# Altium schematic sheet SlowDAC.SchDoc: Slow DAC
size Letter
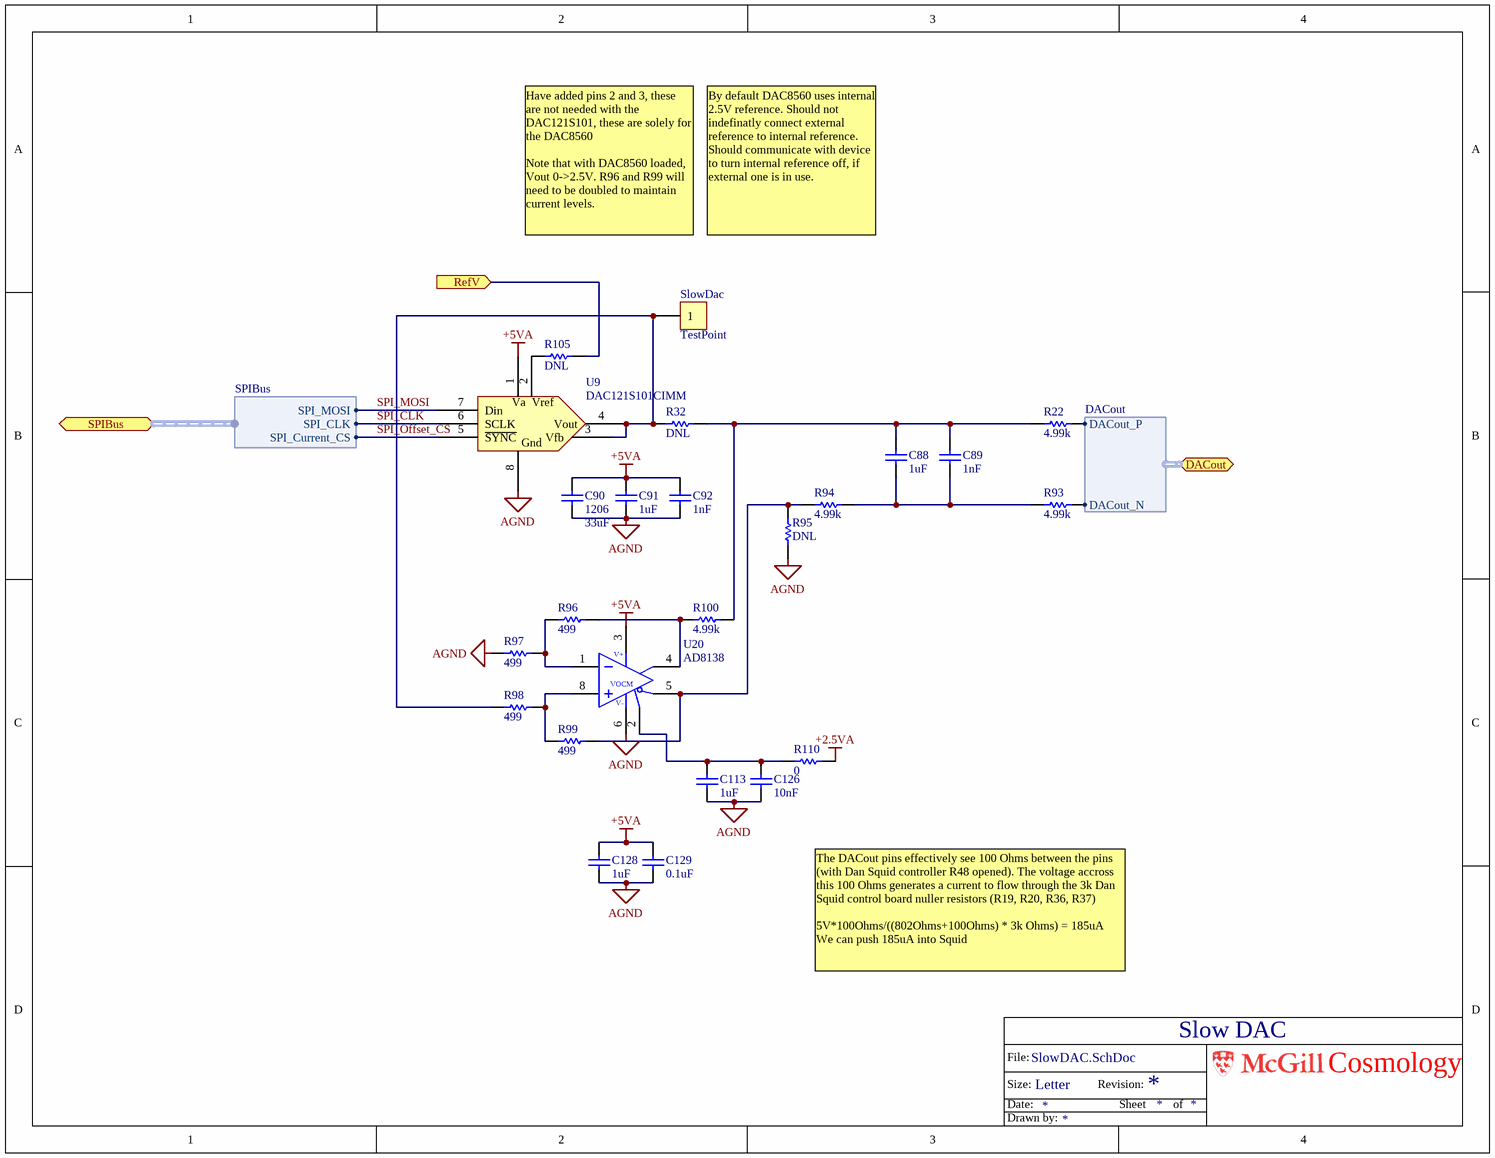
[diagram p0: SlowDAC.SchDoc]

## Parts
C88  1uF  [0603]
C89  1nF  [0603]
C90  Footprint: 1206  [CC3225-1210]  (hidden comment: 33uF)
C91  1uF  [0603]
C92  1nF  [0603]
C113  1uF  [0603]
C126  10nF  [0603]
C128  1uF  [0603]
C129  0.1uF  [0603]
R22  4.99k  [0603]
R32  DNL  [0603]
R93  4.99k  [0603]
R94  4.99k  [0603]
R95  DNL  [0603]
R96  499  [0603]
R97  499  [0603]
R98  499  [0603]
R99  499  [0603]
R100  4.99k  [0603]
R105  DNL  [0603]
R110  0  [0603]
SlowDac  TestPoint  [TP-3520-SK]  (no BOM)
U9  DAC121S101CIMM  [MSOP-8]
U20  AD8138  [SO8]

## Ports
DACout (harness DACout), RefV (in), SPIBus (harness SPIBus)

## Harnesses
DACout: DACout_N, DACout_P
SPIBus: SPI_MOSI, SPI_CLK, SPI_Current_CS

## Nets
+2.5VA: R110.1
+5VA: C90.2 C91.2 C92.2 C128.2 C129.1 U9.1(Va) U20.3(V+)
AGND: C90.1 C91.1 C92.1 C113.1 C126.1 C128.1 C129.2 R95.2 R97.2 U9.8(Gnd) U20.6(V-)
RefV: R105.2 ; port RefV
SPI_CLK: U9.6(SCLK) ; port SPIBus.SPI_CLK
SPI_MOSI: U9.7(Din) ; port SPIBus.SPI_MOSI
SPI_Offset_CS: U9.5(~{SYNC}) ; port SPIBus.SPI_Current_CS
NetC88_1: C88.1 C89.1 R93.2 R94.1
NetC88_2: C88.2 C89.2 R22.2 R32.1 R100.1
NetC113_2: C113.2 C126.2 R110.2 U20.2(VOCM)
NetR22_1: R22.1 ; port DACout.DACout_P
NetR32_2: R32.2 R98.2 SlowDac.1 U9.3(NC) U9.4(Vout)
NetR93_1: R93.1 ; port DACout.DACout_N
NetR94_2: R94.2 R95.1 R99.1 U20.5(OUT-)
NetR96_1: R96.1 R100.2 U20.4(OUT+)
NetR96_2: R96.2 R97.1 U20.1(IN-)
NetR98_1: R98.1 R99.2 U20.8(IN+)
NetR105_1: R105.1 U9.2(NC)

Not connected (* = marked no-connect by the designer): U20 7(NC)

## Notes on the sheet
- Have added pins 2 and 3, these are not needed with the DAC121S101, these are solely for the DAC8560
  Note that with DAC8560 loaded, Vout 0->2.5V. R96 and R99 will need to be doubled to maintain current levels.
- By default DAC8560 uses internal 2.5V reference. Should not indefinatly connect external reference to internal reference. Should communicate with device to turn internal reference off, if external one is in use.
- The DACout pins effectively see 100 Ohms between the pins (with Dan Squid controller R48 opened). The voltage accross this 100 Ohms generates a current to flow through the 3k Dan Squid control board nuller resistors (R19, R20, R36, R37)
  5V*100Ohms/((802Ohms+100Ohms) * 3k Ohms) = 185uA
  We can push 185uA into Squid
- File:
- Size:
- Date:
- Letter
- Revision:
- Sheet
- of
- Cosmology
- Drawn by:

## Library data of the parts
C88 C91 = CAP 0603: Capacitor, Ceramic, 0603; Part Constraints: 10% 16V X7R 0603; Manufacturer: Generic; Manufacturers Part Number: e.g C1608X7R1C105K; Value: 1uF; Type: Capacitor; SupplierUnitCost: $0.12
C89 C92 C129 = CAP 0603: Capacitor, Ceramic, 0603; Part Constraints: 10% 16V X7R 0603; Manufacturer: Generic; Manufacturers Part Number: Generic; Type: Capacitor; SupplierUnitCost: 0
  C89 C92: Value: 1nF
  C129: Value: 0.1uF
C90 = CAP 1210: Capacitor, Ceramic, 1210; Manufacturer: TDK Corporation; Part Constraints: 33uF or 47uF  (1206 or 1210) 25V X5R; Manufacturers Part Number: C3216X5R1E336M; Assembly Comments: none; Type: Capacitor; SupplierUnitCost: $1.1; Value: 33uF; Supplier 1: Digi-Key; Supplier Part Number 1: 445-8046-1-ND
C113 C128 = CAP 0603: Capacitor, Ceramic, 0603; Part Constraints: 10% 16V X7R 0603; Manufacturer: Generic; Manufacturers Part Number: e.g C1608X7R1C105K; Assembly Comments: none; Value: 1uF; Type: Capacitor; SupplierUnitCost: $0.12
C126 = CAP 0603: Capacitor, Ceramic, 0603; Part Constraints: 10% 16V X7R 0603; Manufacturer: Generic; Assembly Comments: none; Manufacturers Part Number: Generic; Value: 10nF; Type: Capacitor; SupplierUnitCost: 0
R22 R32 R93-R100 R105 R110 = RES 0603: Resistor; Manufacturer: Generic; Part Constraints: 1% 1/10W 100ppm 0603; Manufacturers Part Number: Generic; Type: Resistor; SupplierUnitCost: 0
  R22 R93 R94 R100: Value: 4.99k
  R32 R95 R105: Value: DNL
  R96-R99: Value: 499
  R110: Value: 0
SlowDac = TestPoint: TestPoint1; Assembly Comments: none; Footprint: *; Type: Test Point; SupplierUnitCost: 0
U9 = DAC121S101CIMM/NOPB: CONV D/A 12BIT MICROPWR 8MSOP; Manufacturer: National Semiconductor; Settling Time: 12µs; Number of Bits: 12; Data Interface: DSP, MICROWIRE™, QSPI™, Serial, SPI™; Number of Converters: 1; Voltage Supply Source: Single Supply; Power Dissipation (Max): 1.72mW; Number of Outputs and Type: 1 Voltage, Unipolar; 1 Voltage, Bipolar; Assembly Comments: none; RoHS: RoHS Compliant; Category: Integrated Circuits (ICs); Stock 1: 3011; Pricing 1: 1=3.5, 25=2.8616, 100=2.5698, 250=2.33624, 500=2.0442 (CAD); Operating Temperature: -40°C ~ 105°C; Mounting Type: Surface Mount; Package / Case: 8-TSSOP, 8-MSOP (0.118", 3.00mm Width); Supplier Device Package: 8-MSOP; Packaging: Cut Tape (CT); Sampling Rate (Per Second): *; ComponentLink1URL: http://www.ti.com/lit/ds/symlink/dac121s101.pdf; ComponentLink1Description: http://www.ti.com/lit/ds/symlink/dac121s101.pdf; Supplier 1: Digi-Key; Supplier Part Number 1: DAC121S101CIMMCT-ND; Part Constraints: DAC121S101CIMM/NOPB; Manufacturers Part Number: DAC121S101CIMM/NOPB; Type: IC; SupplierUnitCost: $3.70
U20 = AD8138: IC AMP DIFF LDIST LP 95MA 8SOIC; Manufacturer: Analog Devices Inc; Manufacturers Part Number: AD8138ARZ; Assembly Comments: none; Supplier 1: Digi-Key; RoHS: RoHS Compliant; Category: Integrated Circuits (ICs); Type: IC; Applications: Data Acquisition; Mounting Type: Surface Mount; Package / Case: 8-SOIC (0.154", 3.90mm Width); Supplier Device Package: 8-SOIC; Packaging: Tube; ComponentLink1URL: http://www.analog.com/static/imported-files/data_sheets/AD8138.pdf; ComponentLink1Description: http://www.analog.com/static/imported-files/data_sheets/AD8138.pdf; Part Constraints: AD8138ARZ; SupplierUnitCost: $6.44